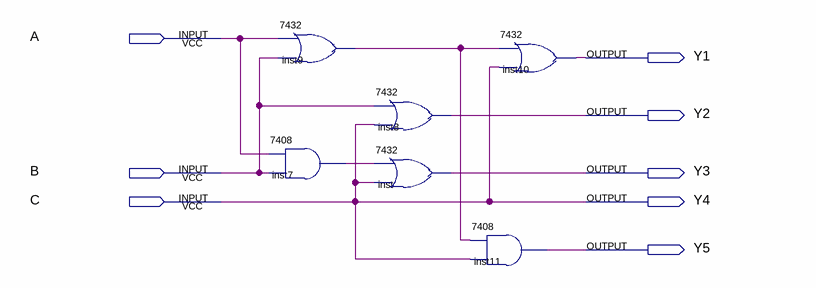
[diagram p0: schematic sheet]
// Quartus schematic LightConverter.bdf as structural Verilog: 6 symbols, 8 pins
module LightConverter (
  input  A,
  input  B,
  input  C,
  output Y1,
  output Y2,
  output Y3,
  output Y4,
  output Y5
);

  wire inst7_1, inst9_1;

  \7432  inst9 (.\2 (A), .\3 (B), .\1 (inst9_1));
  \7408  inst7 (.\3 (B), .\2 (A), .\1 (inst7_1));
  \7432  inst8 (.\2 (B), .\3 (C), .\1 (Y2));
  \7432  inst (.\2 (inst7_1), .\3 (C), .\1 (Y3));
  \7408  inst11 (.\3 (C), .\2 (inst9_1), .\1 (Y5));
  \7432  inst10 (.\2 (inst9_1), .\3 (C), .\1 (Y1));

  assign Y4 = C;
endmodule
